# Altium project PCB_SonarMotorDriver.PrjPcb
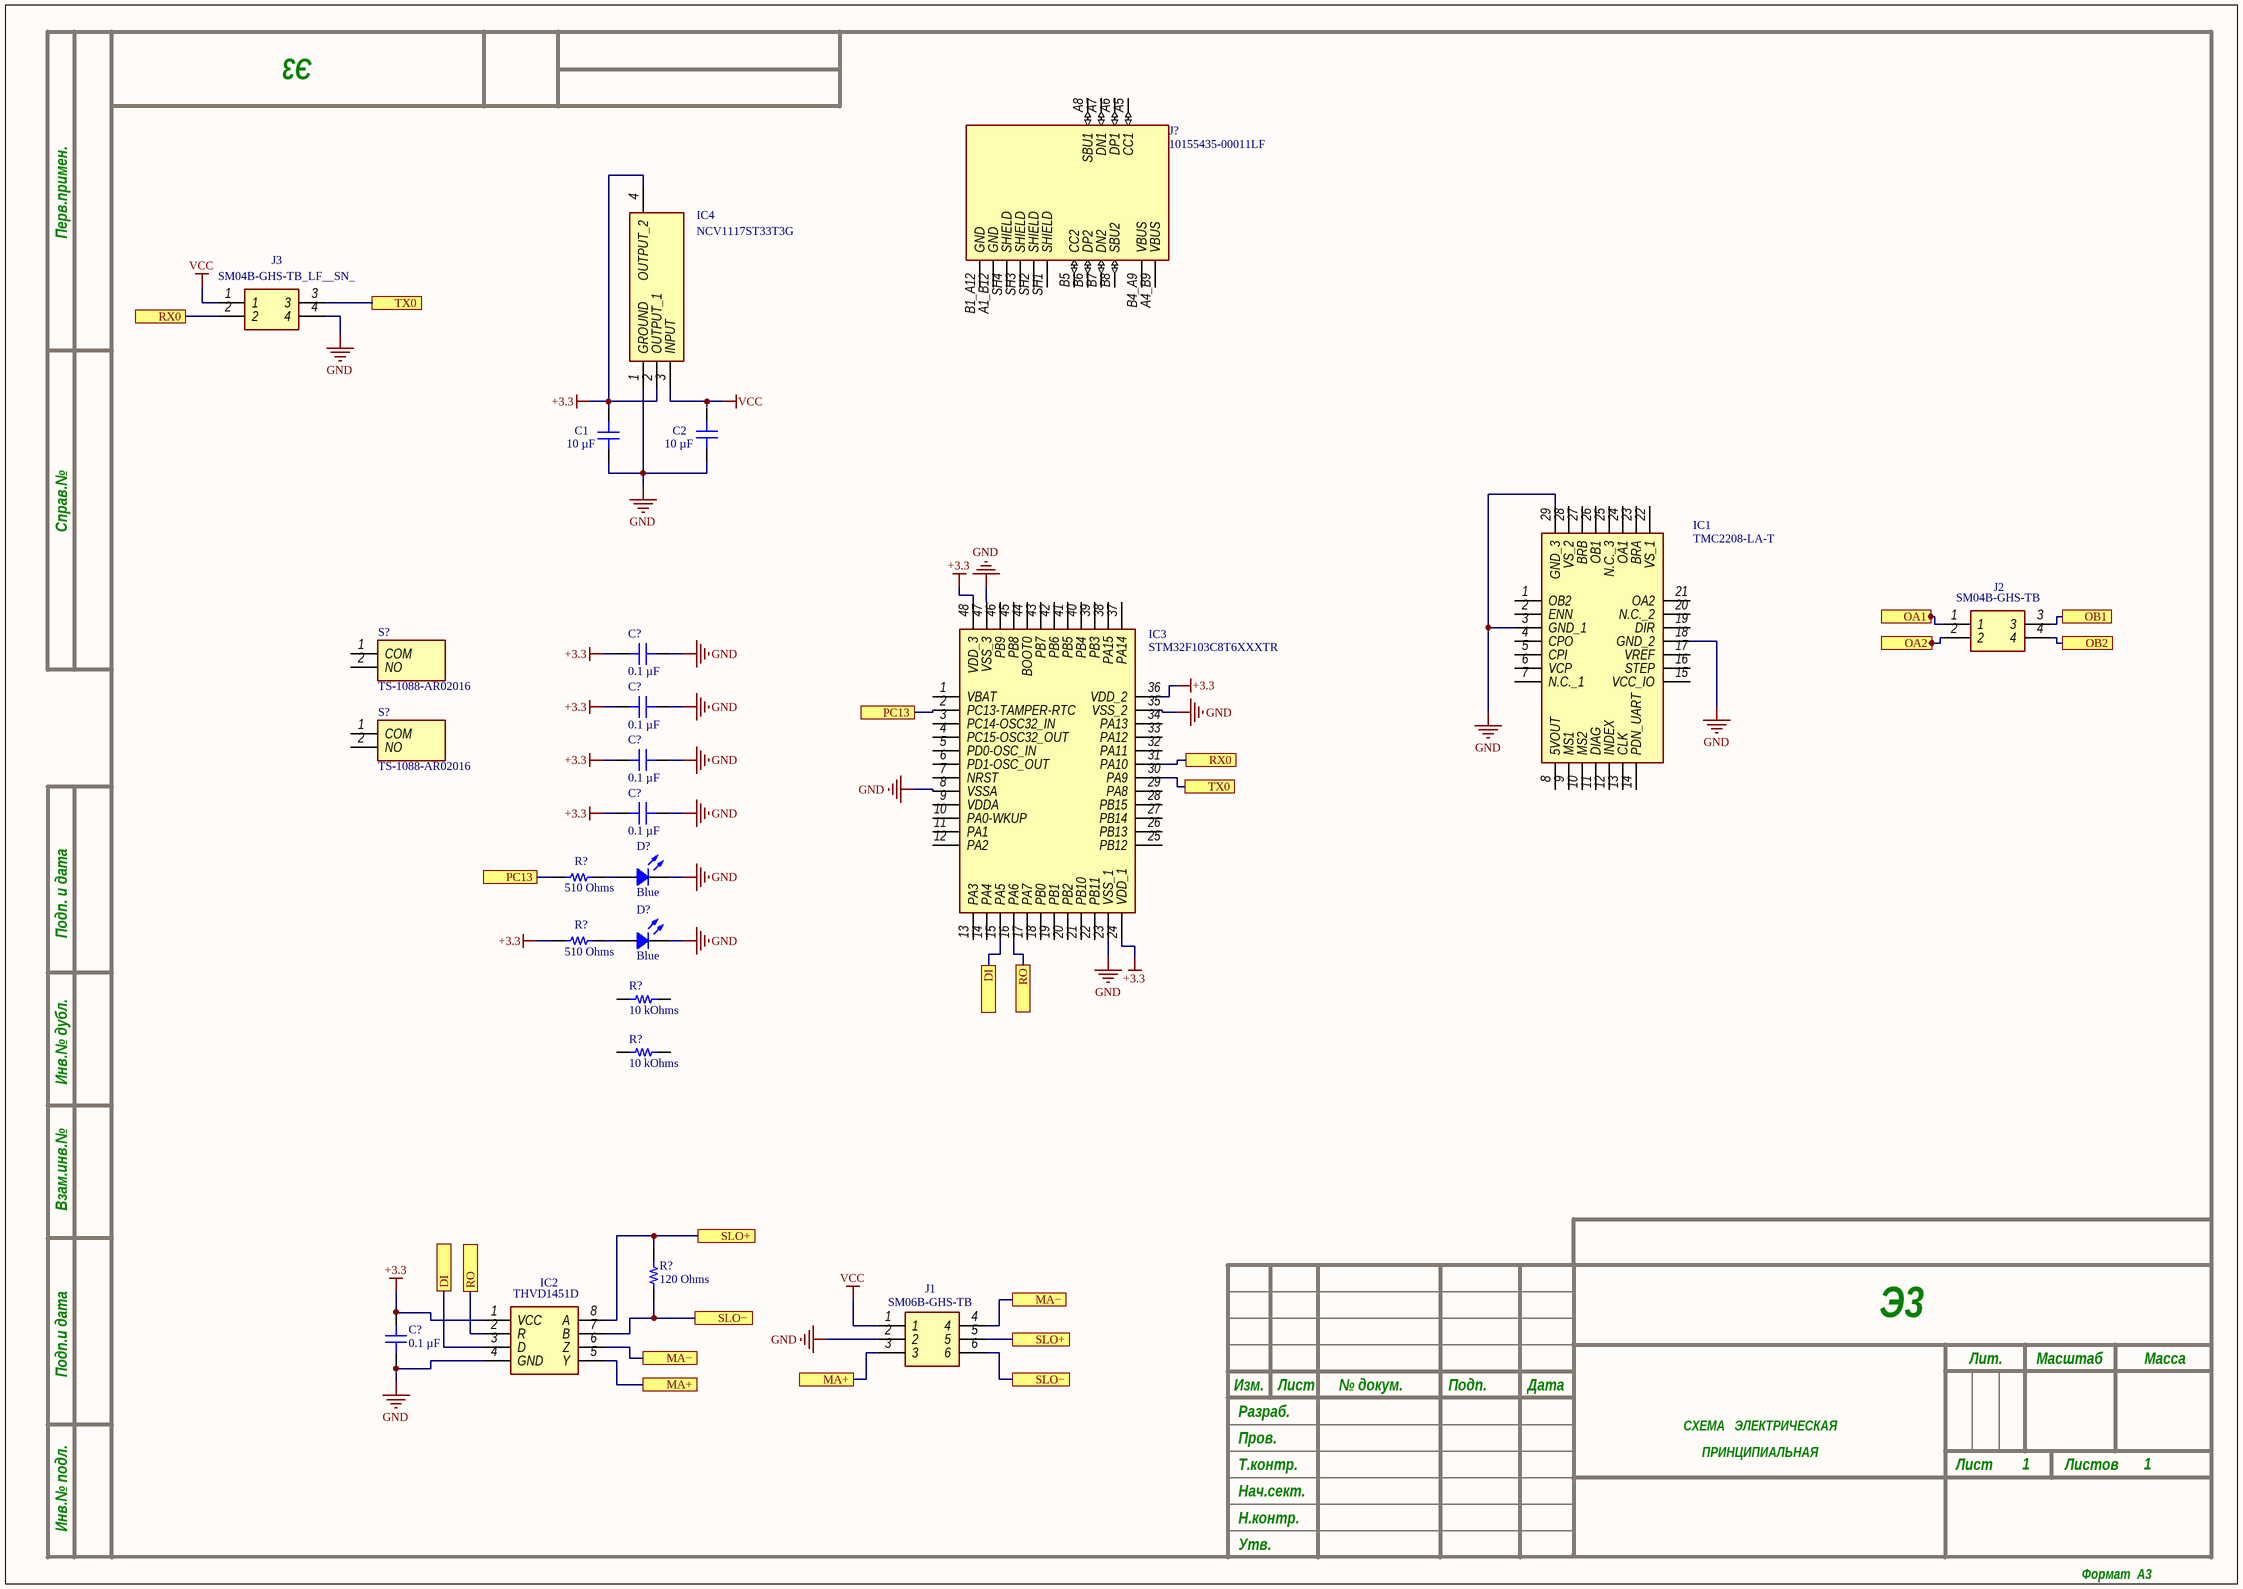
[diagram p0: Sheet_SonarMotorDriver.SchDoc]
1 sheet, 24 parts. Net scope: flat (ports and power ports of the same name join across sheets).
Board file: PCB_SonarMotorDriver.PcbDoc

## Sheet Sheet_SonarMotorDriver.SchDoc
size 420 x 297 mm; SheetNumber: 1; SheetTotal: 1; PageSetup: Record=PageOptions|CenterHorizontal=True|CenterVertical=True|PrintScale=0.94|XCorrection=1.00|YCorrection=1.00|PrintKind=1|BorderSize=5000000|LeftOffset=0|BottomOffset=0|Orientation=1|PaperLength=1000|PaperWidth=1000|Scale=100|PaperSource=7|PrintQuality=-4|MediaType=1|DitherType=10|PaperKind=A4|PrintScaleMode=1; DocumentName: Sheet1.SCHDOC

### Parts
(Parts that share a designator on the sheet are numbered #1, #2 ... from top to bottom, then left to right.)
C1  10 µF  [CAP 0805_2012]
C2  10 µF  [CAP 0805_2012]
C?#1  0.1 µF  [CAP 0603_1608]
C?#2  0.1 µF  [CAP 0603_1608]
C?#3  0.1 µF  [CAP 0603_1608]
C?#4  0.1 µF  [CAP 0603_1608]
C?#5  0.1 µF  [CAP 0603_1608]
D?#1  Blue  [LED 0603_1608 BLUE]
D?#2  Blue  [LED 0603_1608 BLUE]
IC1  TMC2208-LA-T  [QFN50P500X500X90-29N-D]
IC2  THVD1451D  [SOIC127P600X175-8N]
IC3  STM32F103C8T6XXXTR  [QFP50P900X900X160-48N]
IC4  NCV1117ST33T3G  [SOT230P700X180-4N]
J1  SM06B-GHS-TB  [SM06B-GHS-TB]
J2  SM04B-GHS-TB  [SM04B-GHS-TB]
J3  SM04B-GHS-TB_LF__SN_  [SM04B-GHS-TB]
J?  10155435-00011LF  [AMPHENOL_10155435-00011LF]
R?#1  510 Ohms  [YAGEO RES 0603_1608]
R?#2  510 Ohms  [YAGEO RES 0603_1608]
R?#3  10 kOhms  [YAGEO RES 0603_1608]
R?#4  10 kOhms  [YAGEO RES 0603_1608]
R?#5  120 Ohms  [YAGEO RES 0603_1608]
S?#1  TS-1088-AR02016  [TS1088AR02016]
S?#2  TS-1088-AR02016  [TS1088AR02016]

### Ports
DI (see Sheet_SonarMotorDriver[1E]), DI (see Sheet_SonarMotorDriver[2D]), MA+ (see Sheet_SonarMotorDriver[2F]), MA− (see Sheet_SonarMotorDriver[2E]), MA− (see Sheet_SonarMotorDriver[2F]), OA1, OA2, OB1, OB2, PC13 (see Sheet_SonarMotorDriver[1D]), PC13 (see Sheet_SonarMotorDriver[2C]), RO (see Sheet_SonarMotorDriver[1E]), RO (see Sheet_SonarMotorDriver[2D]), RX0 (see Sheet_SonarMotorDriver[1B]), RX0 (see Sheet_SonarMotorDriver[3C]), SLO+ (see Sheet_SonarMotorDriver[2E]), SLO+ (see Sheet_SonarMotorDriver[2F]), SLO− (see Sheet_SonarMotorDriver[2E]), SLO− (see Sheet_SonarMotorDriver[2F]), TX0 (see Sheet_SonarMotorDriver[1B]), TX0 (see Sheet_SonarMotorDriver[3C])

### Nets
+3.3: C1.2 C?#1.2 C?#2.2 C?#3.2 C?#4.2 C?#5.2 IC2.1(VCC) IC3.24(VDD_1) IC3.36(VDD_2) IC3.48(VDD_3) IC4.2(OUTPUT_1) IC4.4(OUTPUT_2) R?#2.1
GND: C1.1 C2.1 C?#1.1 C?#2.1 C?#3.1 C?#4.1 C?#5.1 D?#1.2 D?#2.2 IC1.3(GND_1) IC1.18(GND_2) IC1.29(GND_3) IC2.4(GND) IC3.8(VSSA) IC3.23(VSS_1) IC3.35(VSS_2) IC3.47(VSS_3) IC4.1(GROUND) J1.2 J3.4
VCC: IC4.3(INPUT) J1.1 J3.1
NetD?#1_1: D?#1.1 R?#1.2
NetD?#2_1: D?#2.1 R?#2.2
NetIC2_2: IC2.2(R) IC3.16(PA6) ; port RO
NetIC2_3: IC2.3(D) IC3.15(PA5) ; port DI
NetIC2_5: IC2.5(Y) J1.3 ; port MA+
NetIC2_6: IC2.6(Z) J1.4 ; port MA−
NetIC2_7: IC2.7(B) J1.6 R?#5.1 ; port SLO−
NetIC2_8: IC2.8(A) J1.5 R?#5.2 ; port SLO+
NetIC3_2: IC3.2(PC13-TAMPER-RTC) R?#1.1 ; port PC13
NetIC3_30: IC3.30(PA9) J3.3 ; port TX0
NetIC3_31: IC3.31(PA10) J3.2 ; port RX0
NetJ2_1: J2.1 ; port OA1
NetJ2_2: J2.2 ; port OA2
NetJ2_3: J2.3 ; port OB1
NetJ2_4: J2.4 ; port OB2

Not connected (* = marked no-connect by the designer): C2 2; IC1 1(OB2) 2(ENN) 4(CPO) 5(CPI) 6(VCP) 7(N.C._1) 8(5VOUT) 9(MS1) 10(MS2) 11(DIAG) 12(INDEX) 13(CLK) 14(PDN_UART) 15(VCC_IO) 16(STEP) 17(VREF) 19(DIR) 20(N.C._2) 21(OA2) 22(VS_1) 23(BRA) 24(OA1) 25(N.C._3) 26(OB1) 27(BRB) 28(VS_2); IC3 1(VBAT) 3(PC14-OSC32_IN) 4(PC15-OSC32_OUT) 5(PD0-OSC_IN) 6(PD1-OSC_OUT) 7(NRST) 9(VDDA) 10(PA0-WKUP) 11(PA1) 12(PA2) 13(PA3) 14(PA4) 17(PA7) 18(PB0) 19(PB1) 20(PB2) 21(PB10) 22(PB11) 25(PB12) 26(PB13) 27(PB14) 28(PB15) 29(PA8) 32(PA11) 33(PA12) 34(PA13) 37(PA14) 38(PA15) 39(PB3) 40(PB4) 41(PB5) 42(PB6) 43(PB7) 44(BOOT0) 45(PB8) 46(PB9); J? A1_B12(GND) A4_B9(VBUS) A5(CC1) A6(DP1) A7(DN1) A8(SBU1) B1_A12(GND) B4_A9(VBUS) B5(CC2) B6(DP2) B7(DN2) B8(SBU2) SH1(SHIELD) SH2(SHIELD) SH3(SHIELD) SH4(SHIELD); R?#3 1 2; R?#4 1 2; S?#1 1(COM) 2(NO); S?#2 1(COM) 2(NO)

### Notes on the sheet
- Перв.примен.
- Справ.№
- Подп. и дата
- Инв.№ дубл.
- Взам.инв.№
- Подп.и дата
- Разраб.
- Изм.
- Лист
- № докум.
- Подп.
- Дата
- Лит.
- Масштаб
- Масса
- Т.контр.
- Пров.
- СХЕМА   ЭЛЕКТРИЧЕСКАЯ
- ПРИНЦИПИАЛЬНАЯ
- Листов
- Инв.№ подл.
- Утв.
- Н.контр.
- Нач.сект.
- Формат  A3

### Library data of the parts
C1 C2 = CL21A106KOQNNNE: CAP CER 10UF 16V X5R 0805; manufacturer: Samsung Electro-Mechanics; Tolerance: ±10%; Part Number: CL21A106KOQNNNE; Capacitance: 10 µF; Applications: General Purpose; componentlink1description: Datasheet; componentlink1url: http://www.samsungsem.com/kr/support/product-search/mlcc/CL21A106KOQNNNE.jsp; componentlink2description: DigiKey Link; componentlink2url: https://www.digikey.com/en/products/detail/samsung-electro-mechanics/CL21A106KOQNNNE/3886754; Device Package: 0805 (2012 Metric); lastupdated: 09.02.2024 20:15:37; Lifecycle Status: Active; Minimum Order: 1; Mounting Type: Surface Mount, MLCC; Operating Temperature: -55°C ~ 85°C; Package / Case: 0805 (2012 Metric); packaging: TapeAndReel; partid: 14297; Part Status: Active; price: 0.01; series: CL; Size / Dimension: 0.079" L x 0.049" W (2.00mm x 1.25mm); Supplier 1: DigiKey; Supplier Part Number 1: 1276-1096-1-ND; Temperature Coefficient: X5R; Thickness (Max): 0.055" (1.40mm); value: 10 µF; Voltage - Rated: 16V
C?#1-C?#5 = CC0603KRX7R9BB104: CAP CER 0.1UF 50V X7R 0603; manufacturer: Yageo; Tolerance: ±10%; Part Number: CC0603KRX7R9BB104; Capacitance: 0.1 µF; Applications: General Purpose; componentlink1description: Datasheet; componentlink1url: https://www.yageo.com/upload/media/product/productsearch/datasheet/mlcc/UPY-GPHC_X7R_6.3V-to-50V_18.pdf; componentlink2description: DigiKey Link; componentlink2url: https://www.digikey.com/en/products/detail/yageo/CC0603KRX7R9BB104/2103082; Device Package: 0603 (1608 Metric); lastupdated: 09.02.2024 20:10:21; Lifecycle Status: Active; Minimum Order: 1; Mounting Type: Surface Mount, MLCC; Operating Temperature: -55°C ~ 125°C; Package / Case: 0603 (1608 Metric); packaging: TapeAndReel; partid: 9506; Part Status: Active; price: 0.01; series: CC; Size / Dimension: 0.063" L x 0.031" W (1.60mm x 0.80mm); Supplier 1: DigiKey; Supplier Part Number 1: 311-1344-1-ND; Temperature Coefficient: X7R; Thickness (Max): 0.035" (0.90mm); value: 0.1 µF; Voltage - Rated: 50V
D?#1 D?#2 = LSM0603463V: LED BLUE CLEAR CHIP 0603 SMD; Manufacturer: Visual Communications Company - VCC; Configuration: Standard; Current - Test: 20mA; Lens Color: Colorless; Lens Size: 1.20mm x 0.80mm; Lens Style: Rectangle with Flat Top; Millicandela Rating: 20mcd; Viewing Angle: 120°; Voltage - Forward (Vf) (Typ): 3V; Wavelength - Dominant: 469nm; Part Number: LSM0603463V; Color: Blue; ComponentLink1Description: Datasheet; ComponentLink1URL: https://vcclite.com/wp-content/uploads/wpallimport/files/files/LSM0603463V.pdf; ComponentLink2Description: DigiKey Link; ComponentLink2URL: https://www.digikey.com/en/products/detail/visual-communications-company-vcc/LSM0603463V/9486725; Device Package: 0603 (1608 Metric); Height (Max): 0.50mm; LastUpdated: 03.06.2024 19:57:52; Lens Transparency: Clear; Lifecycle Status: Active; Minimum Order: 1; Mounting Type: Surface Mount; Package / Case: 0603 (1608 Metric); Packaging: TapeAndReel; PartId: 781; Part Status: Active; Price: 0.12; Series: LSM0603; Size / Dimension: 1.60mm L x 0.80mm W; Supplier 1: DigiKey; Supplier Part Number 1: LSM0603463VCT-ND; Supplier Device Package: Chip LED; Value: Blue; Wavelength - Peak: 469nm
IC1 = TMC2208-LA-T: Integrated Circuit; Manufacturer_Name: Analog Devices; Datasheet Link: https://www.analog.com/TMC2208/datasheet; Height: 0.9mm; Manufacturer_Part_Number: TMC2208-LA-T; Mouser Part Number: 700-TMC2208-LA-T; Mouser Price/Stock: https://www.mouser.co.uk/ProductDetail/ADI-Trinamic/TMC2208-LA-T?qs=TiOZkKH1s2TUCbyrI5xF3A%3D%3D; Arrow Part Number: TMC2208-LA-T; Arrow Price/Stock: https://www.arrow.com/en/products/tmc2208-la-t/analog-devices?utm_currency=USD&region=nac
IC2 = THVD1451D: Integrated Circuit; Manufacturer_Name: Texas Instruments; Datasheet Link: https://www.arrow.com/en/products/thvd1451d/texas-instruments; Height: 1.75mm; Manufacturer_Part_Number: THVD1451D; Mouser Part Number: 595-THVD1451D; Mouser Price/Stock: https://www.mouser.co.uk/ProductDetail/Texas-Instruments/THVD1451D?qs=9r4v7xj2Lnm01mh13ntUDQ%3D%3D; Arrow Part Number: THVD1451D; Arrow Price/Stock: https://www.arrow.com/en/products/thvd1451d/texas-instruments?utm_currency=USD&region=europe
IC3 = STM32F103C8T6XXXTR: Integrated Circuit; Manufacturer_Name: STMicroelectronics; Datasheet Link: https://4donline.ihs.com/images/VipMasterIC/IC/SGST/SGSTS49413/SGSTS49413-1.pdf?hkey=EF798316E3902B6ED9A73243A3159BB0; Height: 1.6mm; Manufacturer_Part_Number: STM32F103C8T6XXXTR
IC4 = NCV1117ST33T3G: Integrated Circuit; Manufacturer_Name: onsemi; Datasheet Link: https://www.onsemi.com/pub/Collateral/NCP1117-D.PDF; Height: 1.8mm; Manufacturer_Part_Number: NCV1117ST33T3G; Mouser Part Number: 863-NCV1117ST33T3G; Mouser Price/Stock: https://www.mouser.co.uk/ProductDetail/onsemi/NCV1117ST33T3G?qs=8sOby8ZxZLHgqg5CFzeqiA%3D%3D; Arrow Part Number: NCV1117ST33T3G; Arrow Price/Stock: https://www.arrow.com/en/products/ncv1117st33t3g/on-semiconductor?utm_currency=USD&region=europe
J1 = SM06B-GHS-TB_LF__SN_: Connector; Manufacturer_Name: JST (JAPAN SOLDERLESS TERMINALS); Manufacturer_Part_Number: SM06B-GHS-TB(LF)(SN); Datasheet Link: https://datasheet.datasheetarchive.com/originals/distributors/Datasheets_SAMA/e4ef010dc292ea31091454f6c0afb63a.pdf; Mouser Part Number: N/A; Mouser Price/Stock: https://www.mouser.co.uk/ProductDetail/JST-Commercial/SM06B-GHS-TBLFSN?qs=QpmGXVUTftFzTQe43vH9Ig%3D%3D; Arrow Part Number: SM06B-GHS-TB(LF)(SN); Arrow Price/Stock: https://www.arrow.com/en/products/sm06b-ghs-tb-lf-sn/jst-manufacturing
J2 J3 = SM04B-GHS-TB_LF__SN_: Connector; Manufacturer_Name: JST (JAPAN SOLDERLESS TERMINALS); Manufacturer_Part_Number: SM04B-GHS-TB(LF)(SN); Datasheet Link: http://uk.rs-online.com/web/p/products/7521797; Mouser Part Number: N/A; Mouser Price/Stock: https://www.mouser.co.uk/ProductDetail/JST-Commercial/SM04B-GHS-TBLFSN?qs=QpmGXVUTftEJzKB1YHGCXw%3D%3D; Arrow Part Number: SM04B-GHS-TB(LF)(SN); Arrow Price/Stock: https://www.arrow.com/en/products/sm04b-ghs-tb-lf-sn-/jst-manufacturing?region=europe
R?#1 R?#2 = RC0603FR-07510RL: RES 510 OHM 1% 1/10W 0603; Manufacturer: Yageo; Power (Watts): 0.1W, 1/10W; Temperature Coefficient: ±100ppm/°C; Part Number: RC0603FR-07510RL; Value: 510 Ohms; ComponentLink1Description: Datasheet; ComponentLink1URL: https://www.yageo.com/upload/media/product/productsearch/datasheet/rchip/PYu-RC_Group_51_RoHS_L_10.pdf; ComponentLink2Description: DigiKey Link; ComponentLink2URL: https://www.digikey.com/en/products/detail/yageo/RC0603FR-07510RL/727285; Composition: Thick Film; Device Package: 0603 (1608 Metric); Features: Moisture Resistant; Height - Seated (Max): 0.022" (0.55mm); LastUpdated: 25.07.2024 9:19:21; Lifecycle Status: Active; Minimum Order: 1; Number of Terminations: 2; Operating Temperature: -55°C ~ 155°C; Package / Case: 0603 (1608 Metric); Packaging: CutTape; PartId: 18969; Part Status: Active; Price: 0.01; Resistance: 510 Ohms; Series: RC_L; Size / Dimension: 0.063" L x 0.031" W (1.60mm x 0.80mm); Supplier 1: DigiKey; Supplier Part Number 1: 311-510HRCT-ND; Supplier Device Package: 0603; Tolerance: ±1%
R?#3 R?#4 = RC0603FR-0710KL: RES 10K OHM 1% 1/10W 0603; Manufacturer: Yageo; Power (Watts): 0.1W, 1/10W; Temperature Coefficient: ±100ppm/°C; Part Number: RC0603FR-0710KL; Value: 10 kOhms; ComponentLink1Description: Datasheet; ComponentLink1URL: https://www.yageo.com/upload/media/product/productsearch/datasheet/rchip/PYu-RC_Group_51_RoHS_L_10.pdf; ComponentLink2Description: DigiKey Link; ComponentLink2URL: https://www.digikey.com/en/products/detail/yageo/RC0603FR-0710KL/726880; Composition: Thick Film; Device Package: 0603 (1608 Metric); Features: Moisture Resistant; Height - Seated (Max): 0.022" (0.55mm); LastUpdated: 25.07.2024 9:19:19; Lifecycle Status: Active; Minimum Order: 1; Number of Terminations: 2; Operating Temperature: -55°C ~ 155°C; Package / Case: 0603 (1608 Metric); Packaging: CutTape; PartId: 22599; Part Status: Active; Price: 0.01; Resistance: 10 kOhms; Series: RC_L; Size / Dimension: 0.063" L x 0.031" W (1.60mm x 0.80mm); Supplier 1: DigiKey; Supplier Part Number 1: 311-10.0KHRCT-ND; Supplier Device Package: 0603; Tolerance: ±1%
R?#5 = RC0603FR-07120RL: RES 120 OHM 1% 1/10W 0603; Manufacturer: Yageo; Power (Watts): 0.1W, 1/10W; Temperature Coefficient: ±100ppm/°C; Part Number: RC0603FR-07120RL; Value: 120 Ohms; ComponentLink1Description: Datasheet; ComponentLink1URL: https://www.yageo.com/upload/media/product/productsearch/datasheet/rchip/PYu-RC_Group_51_RoHS_L_10.pdf; ComponentLink2Description: DigiKey Link; ComponentLink2URL: https://www.digikey.com/en/products/detail/yageo/RC0603FR-07120RL/726920; Composition: Thick Film; Device Package: 0603 (1608 Metric); Features: Moisture Resistant; Height - Seated (Max): 0.022" (0.55mm); LastUpdated: 25.07.2024 9:19:21; Lifecycle Status: Active; Minimum Order: 1; Number of Terminations: 2; Operating Temperature: -55°C ~ 155°C; Package / Case: 0603 (1608 Metric); Packaging: CutTape; PartId: 18999; Part Status: Active; Price: 0.01; Resistance: 120 Ohms; Series: RC_L; Size / Dimension: 0.063" L x 0.031" W (1.60mm x 0.80mm); Supplier 1: DigiKey; Supplier Part Number 1: 311-120HRCT-ND; Supplier Device Package: 0603; Tolerance: ±1%
S?#1 S?#2 = TS-1088-AR02016: Switch; Manufacturer_Name: XUNPU; Datasheet Link: https://www.xunpudianzi.com/uploads/pdf/TS-1088-ARXXX.pdf; Height: 2mm; Manufacturer_Part_Number: TS-1088-AR02016
J? = 10155435-00011LF: Package: None; Price: None; Value: *; MP: 10155435-00011LF; Availability: Unavailable